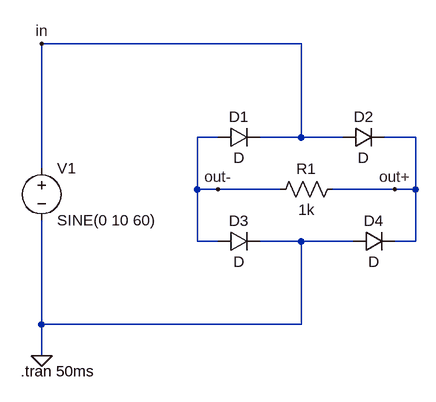
[diagram p0: schematic Full_wave_rectifier2_3.2.asc]
Full_wave_rectifier2_3.2.asc, the LTspice schematic file:
Version 4.1
SHEET 1 880 680
WIRE 384 0 -16 0
WIRE 256 144 224 144
WIRE 384 144 384 0
WIRE 384 144 320 144
WIRE 448 144 384 144
WIRE 560 144 512 144
WIRE -16 192 -16 0
WIRE 224 224 224 144
WIRE 256 224 224 224
WIRE 352 224 256 224
WIRE 528 224 432 224
WIRE 560 224 560 144
WIRE 560 224 528 224
WIRE 224 304 224 224
WIRE 256 304 224 304
WIRE 384 304 320 304
WIRE 464 304 384 304
WIRE 560 304 560 224
WIRE 560 304 528 304
WIRE -16 432 -16 272
WIRE 384 432 384 304
WIRE 384 432 -16 432
WIRE -16 480 -16 432
FLAG 528 224 out+
FLAG -16 480 0
FLAG 256 224 out-
FLAG -16 0 in
SYMBOL diode 256 160 R270
WINDOW 0 32 32 VTop 2
WINDOW 3 0 32 VBottom 2
SYMATTR InstName D1
SYMBOL diode 448 160 R270
WINDOW 0 32 32 VTop 2
WINDOW 3 0 32 VBottom 2
SYMATTR InstName D2
SYMBOL diode 256 320 R270
WINDOW 0 32 32 VTop 2
WINDOW 3 0 32 VBottom 2
SYMATTR InstName D3
SYMBOL diode 464 320 R270
WINDOW 0 32 32 VTop 2
WINDOW 3 0 32 VBottom 2
SYMATTR InstName D4
SYMBOL res 448 208 R90
WINDOW 0 0 56 VBottom 2
WINDOW 3 32 56 VTop 2
SYMATTR InstName R1
SYMATTR Value 1k
SYMBOL voltage -16 176 R0
SYMATTR InstName V1
SYMATTR Value SINE(0 10 60)
TEXT -48 504 Left 2 !.tran 50ms

The netlist it stands for:
* Full_wave_rectifier2_3.2.asc
D1 out- in D
D2 in out+ D
D3 out- 0 D
D4 0 out+ D
R1 out+ out- 1k
V1 in 0 SINE(0 10 60)
.model D D
.lib standard.dio
.tran 50ms
.backanno
.end